# Altium schematic sheet cpu.SchDoc
size A4
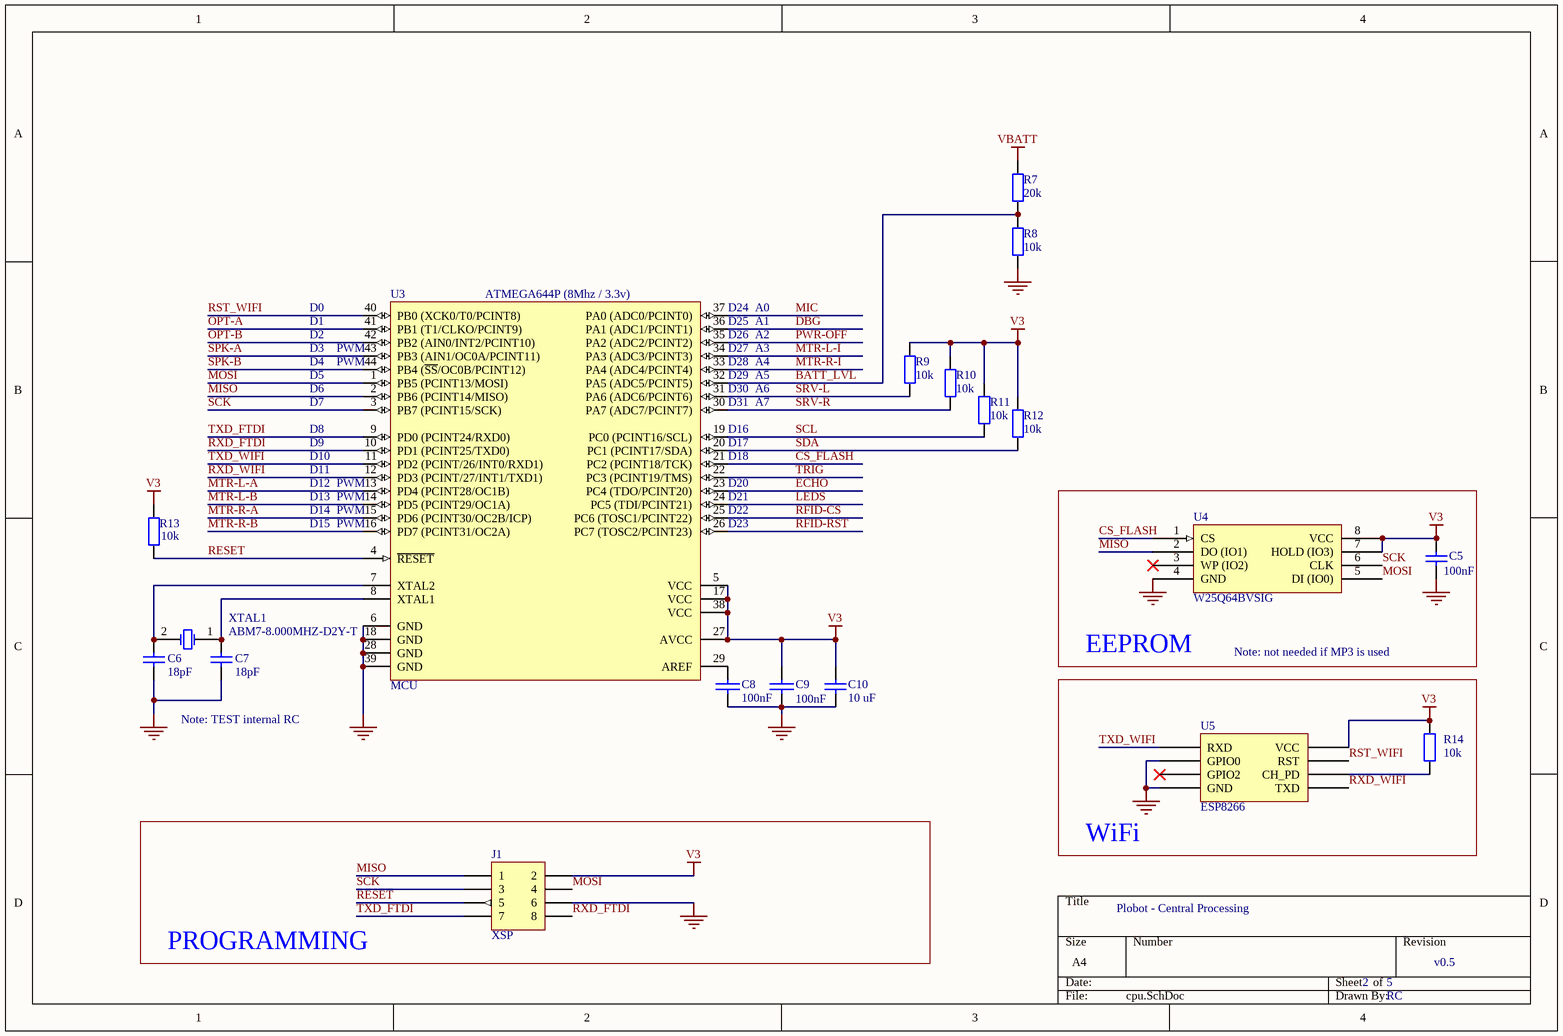
[diagram p0: cpu.SchDoc]

## Parts
C5  100nF  [CAPC1608N]
C6  18pF  [CAPC1608N]
C7  18pF  [CAPC1608N]
C8  100nF  [CAPC1608N]
C9  100nF  [CAPC1608N]
C10  10 uF  [CAPC3216N]
J1  XSP  [HDR2X4H]
R7  20k  [RESC1608N]
R8  10k  [RESC1608N]
R9  10k  [RESC1608N]
R10  10k  [RESC1608N]
R11  10k  [RESC1608N]
R12  10k  [RESC1608N]
R13  10k  [RESC1608N]
R14  10k  [RESC1608N]
U3  MCU  [atmega644p]
U4  W25Q64BVSIG  [W25Q64BVSIG]
U5  ESP8266  [ESP8266]
XTAL1  ABM7-8.000MHZ-D2Y-T  [XTAL]

## Blocks framed on the sheet
EEPROM: C5 U4
WiFi: R14 U5
PROGRAMMING: J1

## Nets
GND: C5.2 C6.1 C7.1 C8.2 C9.2 C10.1 J1.6 R8.1 U3.6(GND) U3.18(GND) U3.28(GND) U3.39(GND) U4.4(GND) U5.GND U5.GPIO0
V3: C5.1 C9.1 C10.2 J1.2 R9.1 R10.1 R11.2 R12.1 R13.1 R14.1 U3.5(VCC) U3.17(VCC) U3.27(AVCC) U3.38(VCC) U4.7(HOLD_(IO3)) U4.8(VCC) U5.VCC
VBATT: R7.2
BATT_LVL: R7.1 R8.2 U3.32(PA5_(ADC5/PCINT5))
CS_FLASH: U3.21(PC2_(PCINT18/TCK)) U4.1(CS)
DBG: U3.36(PA1_(ADC1/PCINT1))
ECHO: U3.23(PC4_(TDO/PCINT20))
LEDS: U3.24(PC5_(TDI/PCINT21))
MIC: U3.37(PA0_(ADC0/PCINT0))
MISO: J1.1 U3.2(PB6_(PCINT14/MISO)) U4.2(DO_(IO1))
MOSI: J1.4 U3.1(PB5_(PCINT13/MOSI)) U4.5(DI_(IO0))
MTR-L-A: U3.13(PD4_(PCINT28/OC1B))
MTR-L-B: U3.14(PD5_(PCINT29/OC1A))
MTR-L-I: U3.34(PA3_(ADC3/PCINT3))
MTR-R-A: U3.15(PD6_(PCINT30/OC2B/ICP))
MTR-R-B: U3.16(PD7_(PCINT31/OC2A))
MTR-R-I: U3.33(PA4_(ADC4/PCINT4))
OPT-A: U3.41(PB1_(T1/CLKO/PCINT9))
OPT-B: U3.42(PB2_(AIN0/INT2/PCINT10))
PWR-OFF: U3.35(PA2_(ADC2/PCINT2))
RESET: J1.5 R13.2 U3.4(~{RESET})
RFID-CS: U3.25(PC6_(TOSC1/PCINT22))
RFID-RST: U3.26(PC7_(TOSC2/PCINT23))
RST_WIFI: U3.40(PB0_(XCK0/T0/PCINT8)) U5.RST
RXD_FTDI: J1.8 U3.10(PD1_(PCINT25/TXD0))
RXD_WIFI: U3.12(PD3_(PCINT/27/INT1/TXD1)) U5.TXD
SCK: J1.3 U3.3(PB7_(PCINT15/SCK)) U4.6(CLK)
SCL: R11.1 U3.19(PC0_(PCINT16/SCL))
SDA: R12.2 U3.20(PC1_(PCINT17/SDA))
SPK-A: U3.43(PB3_(AIN1/OC0A/PCINT11))
SPK-B: U3.44(PB4_(~{SS}/OC0B/PCINT12))
SRV-L: R9.2 U3.31(PA6_(ADC6/PCINT6))
SRV-R: R10.2 U3.30(PA7_(ADC7/PCINT7))
TRIG: U3.22(PC3_(PCINT19/TMS))
TXD_FTDI: J1.7 U3.9(PD0_(PCINT24/RXD0))
TXD_WIFI: U3.11(PD2_(PCINT/26/INT0/RXD1)) U5.RXD
NetC6_2: C6.2 U3.7(XTAL2) XTAL1.2(OSC2)
NetC7_2: C7.2 U3.8(XTAL1) XTAL1.1(OSC1)
NetC8_1: C8.1 U3.29(AREF)
NetR14_2: R14.2 U5.CH_PD

Not connected (* = marked no-connect by the designer): U4 3(WP_(IO2))*; U5 GPIO2*

## Notes on the sheet
- D0
- (near U3) ATMEGA644P (8Mhz / 3.3v)
- (near U3) D24
- A0
- D1
- D2
- D3
- D4
- D5
- (near U3) PWM
- (near U3) D25
- (near U3) D26
- (near U3) D27
- (near U3) D28
- (near U3) D29
- A1
- A2
- A3
- A4
- A5
- D6
- D7
- D8
- D9
- (near U3) D16
- (near U3) D17
- (near U3) D30
- (near U3) D31
- A6
- A7
- D10
- D11
- D12
- D13
- D14
- (near U3) D18
- (near U3) D20
- (near U3) D21
- (near U3) D22
- D15
- (near U3) D23
- Note: not needed if MP3 is used
- Note: TEST internal RC
- Plobot - Central Processing
- 2
- 5
- v0.5
- RC

## Library data of the parts
C5-C9 = Cap: Capacitor
  C5: Published: 8-Jun-2000; LatestRevisionDate: 17-Jul-2002; LatestRevisionNote: Re-released for DXP Platform.; PackageReference: RAD-0.3; Publisher: Altium Limited; PackageDescription: Radial Cap, Thru-Hole; 2 Leads; 0.3 in Pin Spacing; Value: 100nF
  C6 C7: Published: 8-Jun-2000; LatestRevisionDate: 17-Jul-2002; LatestRevisionNote: Re-released for DXP Platform.; PackageReference: RAD-0.3; Publisher: Altium Limited; Value: 18pF
C10 = Cap_2: Capacitor; Published: 8-Jun-2000; LatestRevisionDate: 17-Jul-2002; LatestRevisionNote: Re-released for DXP Platform.; PackageReference: RAD-0.3; Publisher: Altium Limited; PackageDescription: Radial Cap, Thru-Hole; 2 Leads; 0.3 in Pin Spacing; Value: 10 uF
J1 = Header 4X2H: Header, 4-Pin, Dual row, Right Angle; LatestRevisionDate: 17-Jul-2002; LatestRevisionNote: Re-released for DXP Platform.; Publisher: Altium Limited
R7-R14 = Res2: Resistor; Published: 8-Jun-2000; LatestRevisionDate: 17-Jul-2002; LatestRevisionNote: Re-released for DXP Platform.; PackageReference: AXIAL-0.4; Publisher: Altium Limited
  R7: Value: 20k
  R8-R14: Value: 10k
U3 = ATmega644-20AU: 8-bit AVR Microcontroller, 2.7-5.5V, 20MHz, 64KB Flash, 2KB EEPROM, 4KB SRAM, 44-pin TQFP; DatasheetVersion: revN, Jul-2010; PackageVersion: revC, Oct-2010; PackageReference: 44A; PackageDescription: 44-Pin Plastic Thin Profile Quad Flat Pack, 10 x 10 x 1.0 mm Body, 0.8 mm Pitch (TQFP); Code_JEDEC: MS-026-ACB; ComponentLink1Description: Manufacturer URL; ComponentLink1URL: http://www.atmel.com/; ComponentLink2Description: ATmega644 Datasheet; ComponentLink2URL: http://www.atmel.com/dyn/resources/prod_documents/doc2593.pdf; ComponentLink3Description: ATmega644 Summary; ComponentLink3URL: http://www.atmel.com/dyn/resources/prod_documents/2593S.pdf